# Altium project can_bridge.PrjPcb
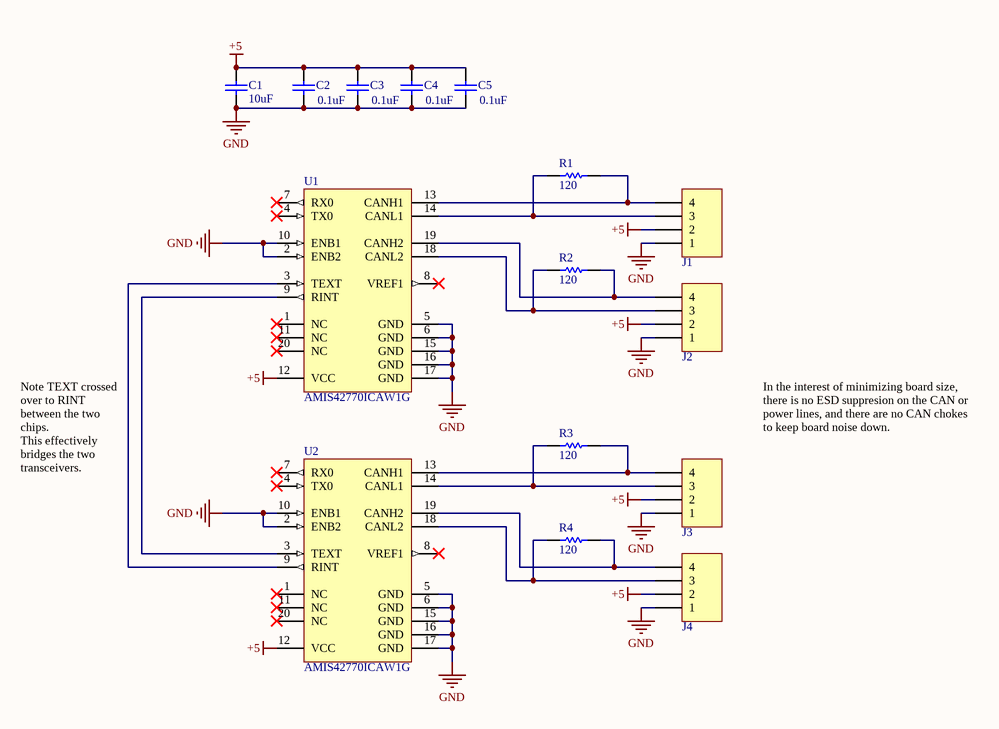
[diagram p0: can_bridge.SchDoc]
1 sheet, 15 parts. Net scope: global (net labels, ports and power ports of the same name join across sheets).

## Sheet can_bridge.SchDoc
size A

### Parts
C1  Capacitance: 10uF  [CAP_0805]  (hidden comment: Cap)
C2  Capacitance: 0.1uF  [CAP_0603]  (hidden comment: Cap)
C3  Capacitance: 0.1uF  [CAP_0603]  (hidden comment: Cap)
C4  Capacitance: 0.1uF  [CAP_0603]  (hidden comment: Cap)
C5  Capacitance: 0.1uF  [CAP_0603]  (hidden comment: Cap)
J1  0430450401  [Molex_0430450401]  (value not drawn)
J2  0430450401  [Molex_0430450401]  (value not drawn)
J3  0430450401  [Molex_0430450401]  (value not drawn)
J4  0430450401  [Molex_0430450401]  (value not drawn)
R1  Resistance: 120  [RES_0603]  (hidden comment: Res1)
R2  Resistance: 120  [RES_0603]  (hidden comment: Res1)
R3  Resistance: 120  [RES_0603]  (hidden comment: Res1)
R4  Resistance: 120  [RES_0603]  (hidden comment: Res1)
U1  AMIS42770ICAW1G  [ONSC-SOIC-20-751AQ-01_N]
U2  AMIS42770ICAW1G  [ONSC-SOIC-20-751AQ-01_N]

### Nets
+5: C1.2 C2.2 C3.2 C4.2 C5.2 J1.2 J2.2 J3.2 J4.2 U1.12(VCC) U2.12(VCC)
GND: C1.1 C2.1 C3.1 C4.1 C5.1 J1.1 J2.1 J3.1 J4.1 U1.2(ENB2) U1.5(GND) U1.6(GND) U1.10(ENB1) U1.15(GND) U1.16(GND) U1.17(GND) U2.2(ENB2) U2.5(GND) U2.6(GND) U2.10(ENB1) U2.15(GND) U2.16(GND) U2.17(GND)
NetJ1_3: J1.3 R1.1 U1.14(CANL1)
NetJ1_4: J1.4 R1.2 U1.13(CANH1)
NetJ2_3: J2.3 R2.1 U1.18(CANL2)
NetJ2_4: J2.4 R2.2 U1.19(CANH2)
NetJ3_3: J3.3 R3.1 U2.14(CANL1)
NetJ3_4: J3.4 R3.2 U2.13(CANH1)
NetJ4_3: J4.3 R4.1 U2.18(CANL2)
NetJ4_4: J4.4 R4.2 U2.19(CANH2)
NetU1_3: U1.3(TEXT) U2.9(RINT)
NetU1_9: U1.9(RINT) U2.3(TEXT)

Not connected (* = marked no-connect by the designer): U1 1(NC)* 4(TX0)* 7(RX0)* 8(VREF1)* 11(NC)* 20(NC)*; U2 1(NC)* 4(TX0)* 7(RX0)* 8(VREF1)* 11(NC)* 20(NC)*

### Notes on the sheet
- Note TEXT crossed over to RINT between the two chips.
  This effectively bridges the two transceivers.
- In the interest of minimizing board size, there is no ESD suppresion on the CAN or power lines, and there are no CAN chokes to keep board noise down.

### Library data of the parts
C1 = LMK212BJ106KG-T: CAP CER 10UF 10V X5R 0805; Supplier 1: Digi-Key; Supplier Part Number 1: 587-1300-1-ND
C2-C5 = EMK107B7104KA-T: CAP CER 0.1UF 16V X7R 0603; Supplier 1: Digi-Key; Supplier Part Number 1: 587-1240-1-ND
J1-J4 = 0430450401: HEADER R/A 4POS DUAL GOLD T/H; Supplier 1: Digi-Key; Supplier Part Number 1: WM3248-ND
R1-R4 = ERJ-3EKF1200V: Supplier 1: Digi-Key; Supplier Part Number 1: P120HCT-ND
U1 U2 = CMP-1313-00055-1: Dual High Speed CAN Transceivers, 4.75 to 5.25 V, -40 to 125 degC, 20-Pin SOIC, Pb-Free, Tube; Manufacturer: On Semiconductor; VCC Max (V): 5.25; VCC Min (V): 4.75; Data Rate: 1 Mb/s; Number of Receivers: 1; Mounting Technology: Surface Mount; PackageVersion: Rev. O, 06/2008; PackageDescription: 20-Pin Small Outline Integrated Circuit, Body 12.78 x 7.51 mm, Pitch 1.27 mm; ComponentLink1URL: http://www.onsemi.com/; DatasheetVersion: Rev. 3; ComponentLink1Description: Manufacturer URL; ComponentLink2URL: http://www.onsemi.com/pub_link/Collateral/AMIS-42770-D.PDF; RoHS: TRUE; PartNumber: AMIS42770ICAW1G; PackageReference: SOIC-20-751AQ-01; Packing: Tube; ComponentLink3URL: http://www.onsemi.com/pub_link/Collateral/751AQ.PDF; Data Transmission Standard: CAN; ComponentLink2Description: Datasheet; ComponentLink3Description: Package Specification; Number of Drivers: 1; Supplier 1: Digi-Key; Supplier Part Number 1: AMIS42770ICAW1GOS-ND